# Altium schematic sheet CH32M030C9U_PD-EVT.SchDoc
size A3; SheetNumber: 1; SheetTotal: 1
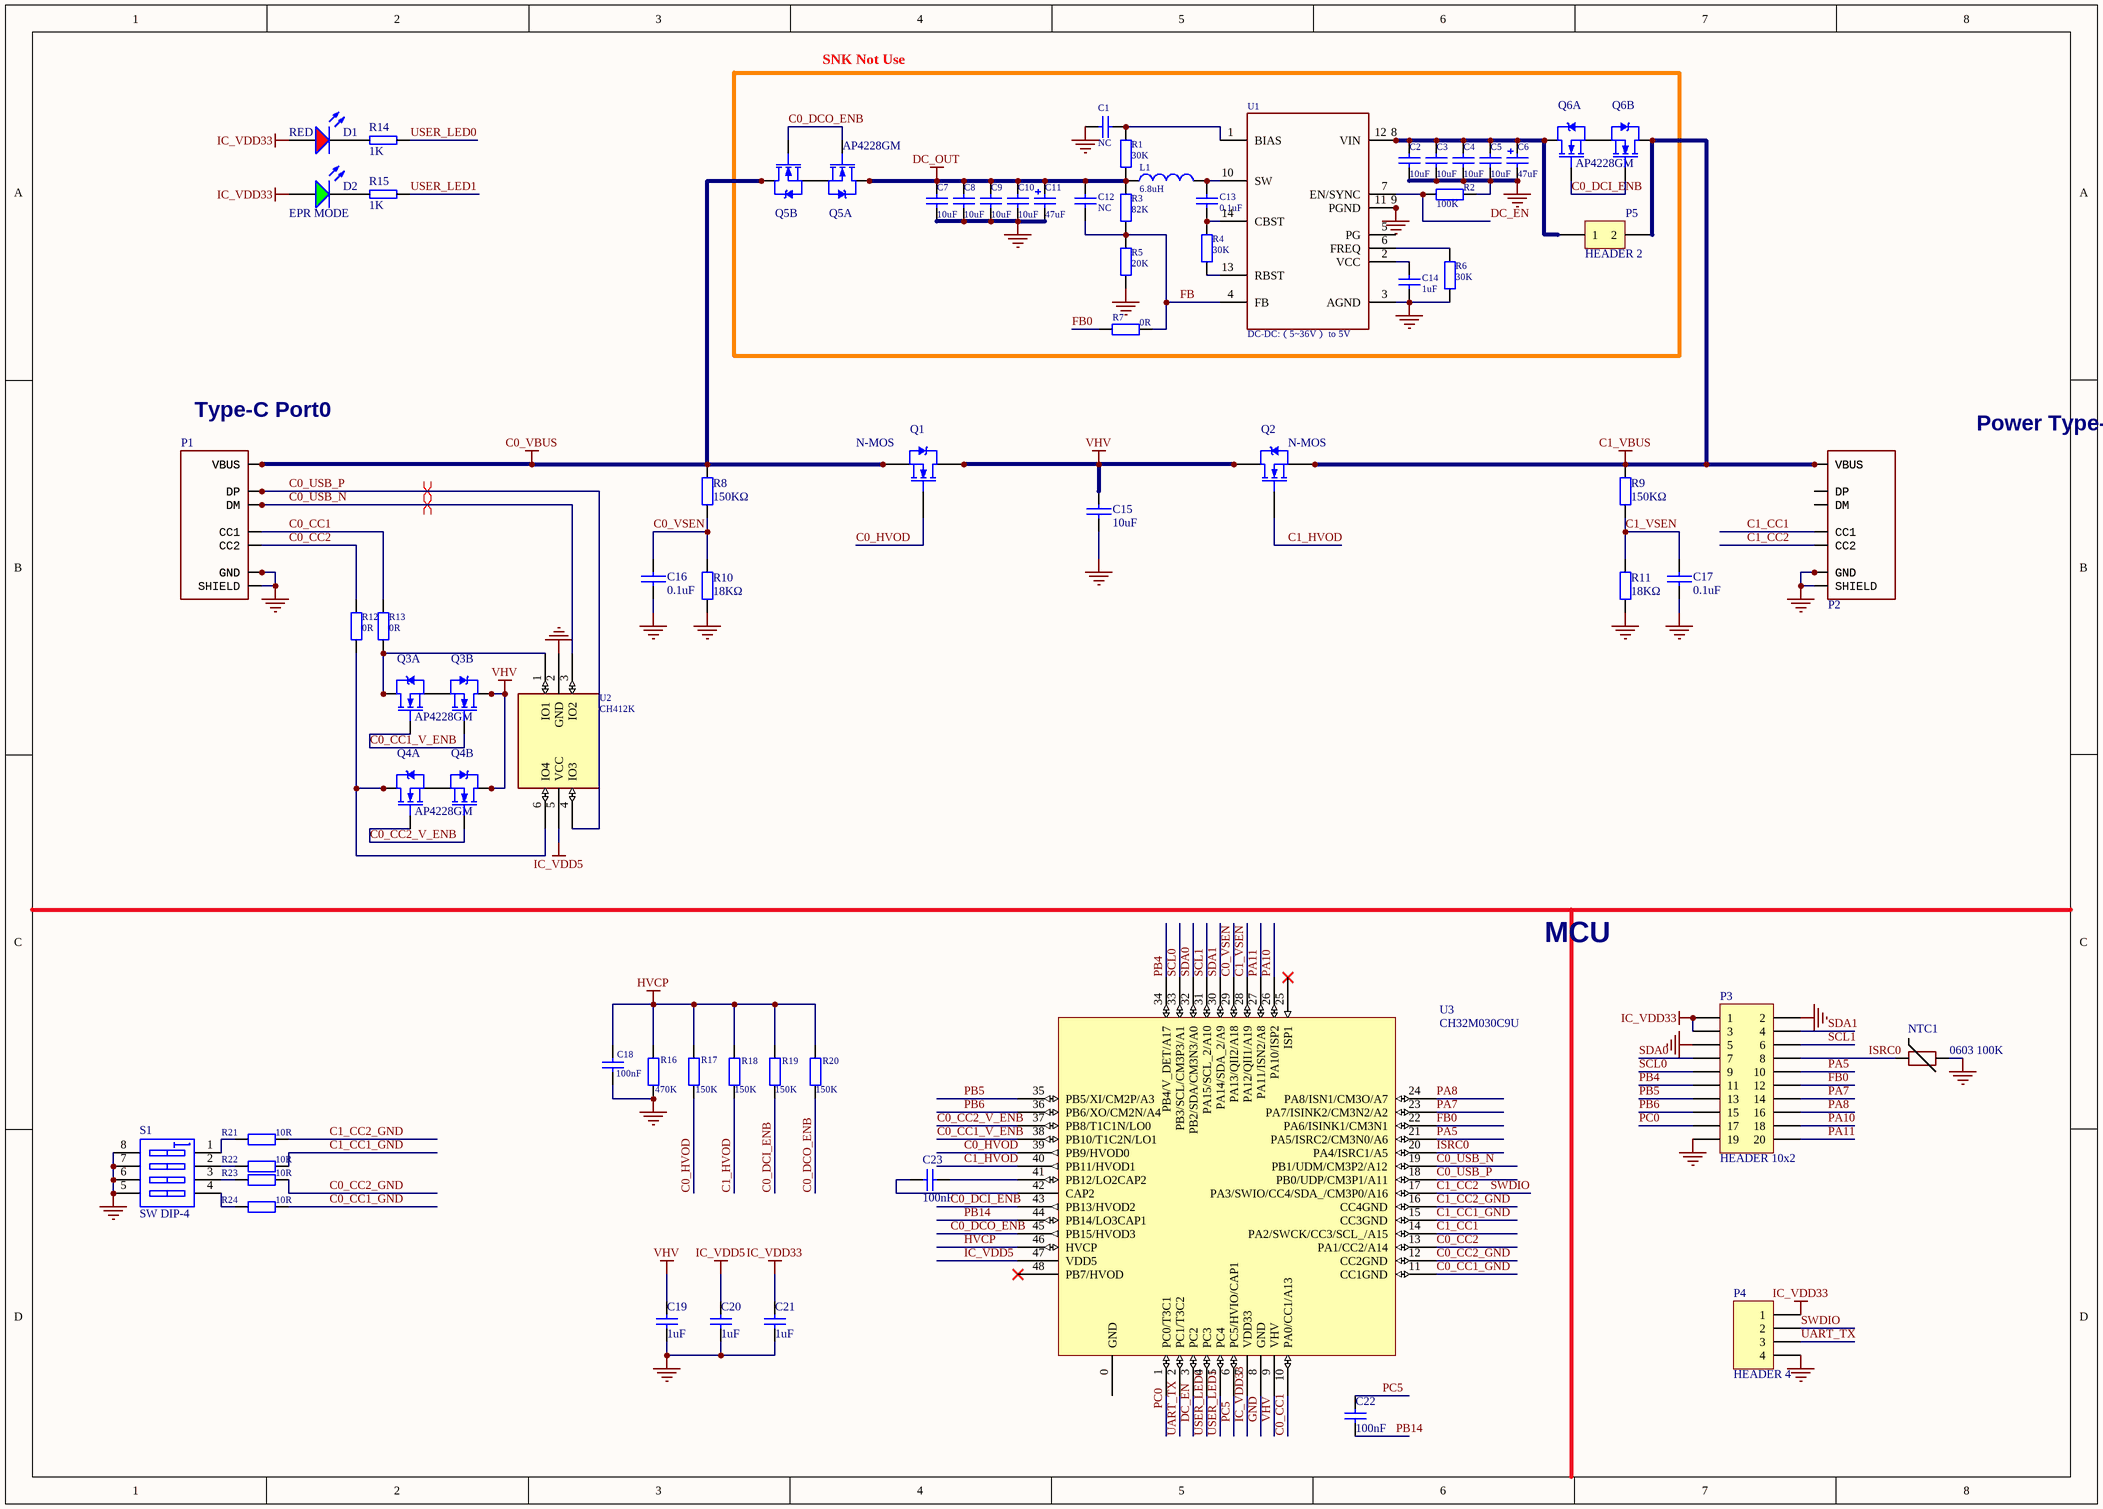
[diagram p0: CH32M030C9U_PD-EVT.SchDoc]

## Parts
C1  NC  [0402_C]
C2  10uF  [0603_C]
C3  10uF  [0603_C]
C4  10uF  [0603_C]
C5  10uF  [0603_C]
C6  47uF  [1206_C]
C7  10uF  [0603_C]
C8  10uF  [0603_C]
C9  10uF  [0603_C]
C10  10uF  [0603_C]
C11  47uF  [1206_C]
C12  NC  [0402_C]
C13  0.1uF  [0402_C]
C14  1uF  [0402_C]
C15  10uF  [0603_C]
C16  0.1uF  [0402_C]
C17  0.1uF  [0402_C]
C18  100nF  [0402_C]
C19  1uF  [0402_C]
C20  1uF  [0402_C]
C21  1uF  [0402_C]
C22  100nF  [0402_C]
C23  100nF  [0402_C]
D1  RED  [0603+]
D2  EPR MODE  [0603+]
L1  6.8uH  [IND-SMD_L11.5-W10.0]
NTC1  0603 100K  [0603]
P1  TYPE-C-Receptacle-RefDesign  [TYPE-C-Receptacle-2.0]  (value not drawn)
P2  TYPE-C-Receptacle-RefDesign  [TYPE-C-Receptacle-2.0]  (value not drawn)
P3  HEADER 10x2  [IDC20-2.54MM]
P4  HEADER 4  [SIP4-2.54mm]
P5  HEADER 2  [SIP2-2.54mm]
Q1  N-MOS  [DFN-8_L3.1-W3.0-P0.65-LS3.3-BL]
Q2  N-MOS  [DFN-8_L3.1-W3.0-P0.65-LS3.3-BL]
Q3  AP4228GM  [DFN-8_Dual_EP_3x3mm]  (parts A,B of 2)
Q4  AP4228GM  [DFN-8_Dual_EP_3x3mm]  (parts A,B of 2)
Q5  AP4228GM  [DFN-8_Dual_EP_3x3mm]  (parts A,B of 2)
Q6  AP4228GM  [DFN-8_Dual_EP_3x3mm]  (parts A,B of 2)
R1  30K  [0402]
R2  100K  [0402]
R3  82K  [0402]
R4  30K  [0402]
R5  20K  [0402]
R6  30K  [0402]
R7  0R  [0402]
R8  150KΩ  [0402]
R9  150KΩ  [0402]
R10  18KΩ  [0402]
R11  18KΩ  [0402]
R12  0R  [0402]
R13  0R  [0402]
R14  1K  [0402]
R15  1K  [0402]
R16  470K  [0402]
R17  150K  [0402]
R18  150K  [0402]
R19  150K  [0402]
R20  150K  [0402]
R21  10R  [0402]
R22  10R  [0402]
R23  10R  [0402]
R24  10R  [0402]
S1  SW DIP-4  [SW-TH_8P-P2.54-LS7.62]
U1  DC-DC:（5~36V） to 5V  [EVQFN14_4X3.5]
U2  CH412K  [SOT-363]
U3  CH32M030C9U  [QFN48_5X5]

## Blocks framed on the sheet
SNK Not Use: C1-C14 L1 P5 Q5 Q6 R1-R7 U1

## Nets
C0_VBUS: P1.A4(VBUS) P1.A9(VBUS) P1.B4(VBUS) P1.B9(VBUS) Q1.1(S) Q1.2 Q1.3 Q5.5(D2) Q5.6(D2) R8.1
C1_VBUS: P2.A4(VBUS) P2.A9(VBUS) P2.B4(VBUS) P2.B9(VBUS) P5.2 Q2.1(S) Q2.2 Q2.3 Q6.5(D2) Q6.6(D2) R9.1
DC_OUT: C7.2 C8.2 C9.2 C10.2 C11.1 C12.2 L1.2 Q5.7(D1) Q5.8(D1) R1.2 R3.1
GND: C1.2 C2.1 C3.1 C4.1 C5.1 C6.2 C7.1 C8.1 C9.1 C10.1 C11.2 C14.2 C15.1 C16.1 C17.1 C18.2 C19.2 C20.2 C21.2 NTC1.2 P1.0(SHIELD) P1.A1(GND) P1.A12(GND) P1.B1(GND) P1.B12(GND) P2.0(SHIELD) P2.A1(GND) P2.A12(GND) P2.B1(GND) P2.B12(GND) P3.2 P3.5 P3.19 P4.4 R2.2 R5.2 R6.2 R10.2 R11.2 R16.1 S1.5 S1.6 S1.7 S1.8 U1.3(AGND) U1.9(PGND) U1.11(PGND) U2.2(GND) U3.8(GND)
HVCP: C18.1 R16.2 R17.2 R18.2 R19.2 R20.2 U3.46(HVCP)
IC_VDD5: C20.1 U2.5(VCC) U3.47(VDD5)
IC_VDD33: C21.1 D1.1(A) D2.1(A) P3.1 P3.3 P4.1 U3.7(VDD33)
VHV: C15.2 C19.1 Q1.5(D) Q1.6 Q1.7 Q1.8 Q2.5(D) Q2.6 Q2.7 Q2.8 Q3.5(D2) Q3.6(D2) Q4.5(D2) Q4.6(D2) U3.9(VHV)
C0_CC1: P1.A5(CC1) R13.1 U3.10(PA0/CC1/A13)
C0_CC1_GND: R24.1 U3.11(CC1GND)
C0_CC1_V_ENB: Q3.2(G1) Q3.4(G2) U3.38(PB10/T1C2N/LO1)
C0_CC2: P1.B5(CC2) R12.1 U3.13(PA1/CC2/A14)
C0_CC2_GND: R23.1 U3.12(CC2GND)
C0_CC2_V_ENB: Q4.2(G1) Q4.4(G2) U3.37(PB8/T1C1N/LO0)
C0_DCI_ENB: Q6.2(G1) Q6.4(G2) R19.1 U3.43(PB13/HVOD2)
C0_DCO_ENB: Q5.2(G1) Q5.4(G2) R20.1 U3.45(PB15/HVOD3)
C0_HVOD: Q1.4(G) R17.1 U3.39(PB9/HVOD0)
C0_USB_N: P1.A7(DM) P1.B7(DM) U2.3(IO2) U3.19(PB1/UDM/CM3P2/A12)
C0_USB_P: P1.A6(DP) P1.B6(DP) U2.4(IO3) U3.18(PB0/UDP/CM3P1/A11)
C0_VSEN: C16.2 R8.2 R10.1 U3.29(PA13/QII2/A18)
C1_CC1: P2.A5(CC1) U3.14(PA2/SWCK/CC3/SCL_/A15)
C1_CC1_GND: R22.1 U3.15(CC3GND)
C1_CC2: P2.B5(CC2) P4.2 U3.17(PA3/SWIO/CC4/SDA_/CM3P0/A16)  [also labelled SWDIO]
C1_CC2_GND: R21.1 U3.16(CC4GND)
C1_HVOD: Q2.4(G) R18.1 U3.40(PB11/HVOD1)
C1_VSEN: C17.2 R9.2 R11.1 U3.28(PA12/QII1/A19)
DC_EN: R2.1 U1.7(EN/SYNC) U3.3(PC2)
FB: C12.1 R3.2 R5.1 R7.2 U1.4(FB)
FB0: P3.12 R7.1 U3.22(PA6/ISINK1/CM3N1)
ISRC0: NTC1.1 P3.8 U3.20(PA4/ISRC1/A5)
PA5: P3.10 U3.21(PA5/ISRC2/CM3N0/A6)
PA7: P3.14 U3.23(PA7/ISINK2/CM3N2/A2)
PA8: P3.16 U3.24(PA8/ISN1/CM3O/A7)
PA10: P3.18 U3.26(PA10/ISP2)
PA11: P3.20 U3.27(PA11/ISN2/A8)
PB4: P3.11 U3.34(PB4/V_DET/A17)
PB5: P3.13 U3.35(PB5/XI/CM2P/A3)
PB6: P3.15 U3.36(PB6/XO/CM2N/A4)
PB14: C22.1 U3.44(PB14/LO3CAP1)
PC0: P3.17 U3.1(PC0/T3C1)
PC5: C22.2 U3.6(PC5/HVIO/CAP1)
SCL0: P3.9 U3.33(PB3/SCL/CM3P3/A1)
SCL1: P3.6 U3.31(PA15/SCL_2/A10)
SDA0: P3.7 U3.32(PB2/SDA/CM3N3/A0)
SDA1: P3.4 U3.30(PA14/SDA_2/A9)
UART_TX: P4.3 U3.2(PC1/T3C2)
USER_LED0: R14.2 U3.4(PC3)
USER_LED1: R15.2 U3.5(PC4)
NetC1_1: C1.1 R1.1 U1.1(BIAS)
NetC2_2: C2.2 C3.2 C4.2 C5.2 C6.1 P5.1 Q6.7(D1) Q6.8(D1) U1.8(VIN) U1.12(VIN)
NetC13_1: C13.1 R4.1 U1.14(CBST)
NetC13_2: C13.2 L1.1 U1.10(SW)
NetC14_1: C14.1 U1.2(VCC)
NetC23_1: C23.1 U3.41(PB12/LO2CAP2)
NetC23_2: C23.2 U3.42(CAP2)
NetD1_2: D1.2(K) R14.1
NetD2_2: D2.2(K) R15.1
NetP2_A6: P2.A6(DP) P2.B6(DP)
NetP2_A7: P2.A7(DM) P2.B7(DM)
NetQ3_1: Q3.1(S1) Q3.3(S2)
NetQ3_7: Q3.7(D1) Q3.8(D1) R13.2 U2.1(IO1)
NetQ4_1: Q4.1(S1) Q4.3(S2)
NetQ4_7: Q4.7(D1) Q4.8(D1) R12.2 U2.6(IO4)
NetQ5_1: Q5.1(S1) Q5.3(S2)
NetQ6_1: Q6.1(S1) Q6.3(S2)
NetR4_2: R4.2 U1.13(RBST)
NetR6_1: R6.1 U1.6(FREQ)
NetR21_2: R21.2 S1.1
NetR22_2: R22.2 S1.2
NetR23_2: R23.2 S1.3
NetR24_2: R24.2 S1.4

Not connected (* = marked no-connect by the designer): U1 5(PG); U3 0(GND) 25(ISP1)* 48(PB7/HVOD)*

## Layout directives
differential pair: C0_USB_N, C0_USB_P

## Notes on the sheet
- (near P1) Type-C Port0
- (near P2) Power Type-C Port1
- MCU

## Library data of the parts
C1-C5 C7-C10 C12-C14 = 0603 100nF (104) 10% 50V: 贴片电容; ComponentLink1Description: 供应商链接; ComponentLink1URL: http://www.szlcsc.com/product/details_15331.html; Package: 0603; Supplier: LC; SuppliersPartNumber: C14663
C6 C11 = 3216 10uF (106) 10% 16V: 钽电容; ComponentLink1Description: 供应商链接; ComponentLink1URL: http://www.szlcsc.com/product/details_7643.html; Package: 3216; Supplier: LC; SuppliersPartNumber: C7171
C15-C17 = CAP: Capacitor
C18 = 0603 1uF (105) 10% 50V: 贴片电容; ComponentLink1Description: 供应商链接; ComponentLink1URL: http://www.szlcsc.com/product/details_16531.html; Package: 0603; Supplier: LC; SuppliersPartNumber: C15849
C19-C23 = 0402 1.0uF (105) 10% 25V: 贴片电容; ComponentLink1Description: 供应商链接; ComponentLink1URL: http://www.szlcsc.com/product/details_53938.html; Package: 0402; Supplier: LC; SuppliersPartNumber: C52923
D1 = LED-RED: 发光二极管
D2 = LED-GREEN: 发光二极管
L1 = Inductor: C177243; Code_IEC: 1005; Value: 10uH3.5A; Published: 8-Jun-2000; LatestRevisionDate: 29-May-2009; LatestRevisionNote: IPC-7351 Footprint Added.; PackageReference: 0402-A; Publisher: Altium Limited; PackageDescription: Chip Inductor; Code_JEITA: 0402
NTC1 = NTC
P3 = HEADER 10x2: Header, 10-Pin, Dual row
P4 = HEADER 4: Header, 4-Pin
P5 = HEADER 2_1: Header, 2-Pin
Q1 Q2 = N-MOS: N-MOS 8p
Q3-Q6 = AP4228GM: Dual N MOS
R1-R6 = 0603 470Ω (4700) 1%: 贴片电阻; ComponentLink1Description: 供应商链接; ComponentLink1URL: http://www.szlcsc.com/product/details_23906.html; Package: 0603; Supplier: LC; SuppliersPartNumber: C23179
R7 R12 R13 R16-R24 = 0603 100KΩ (1003) 1%: 贴片电阻; ComponentLink1Description: 供应商链接; ComponentLink1URL: http://www.szlcsc.com/product/details_26546.html; Package: 0603; Supplier: LC; SuppliersPartNumber: C25803
R8-R11 = 0603 56KΩ (5602) 1%: 贴片电阻; ComponentLink1Description: 供应商链接; ComponentLink1URL: http://www.szlcsc.com/product/details_23933.html; Package: 0603; Supplier: LC; SuppliersPartNumber: C23206
R14 R15 = RES
S1 = SW DIP-4: DIP Switch, 4 Position, SPST
U1 = DC-DC
U2 = CH412K: Qaud ESD protect, high speed
U3 = CH32M030C9U: RISC-V MCU, 72MHz, USB, Type-C/PD, OPA, CMP, 28V LDO & HVIO